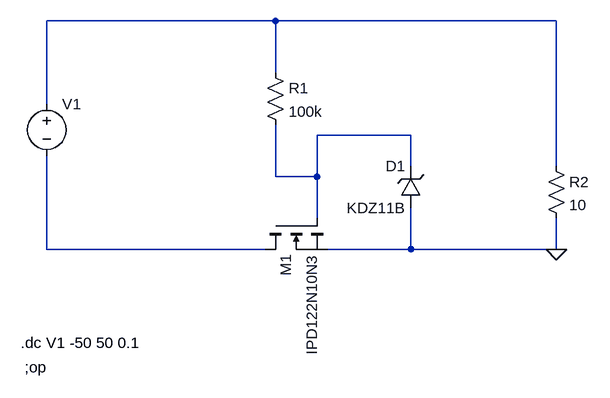
[diagram p0: schematic Draft1.asc]
Draft1.asc, the LTspice schematic file:
Version 4
SHEET 1 880 680
WIRE 288 -64 -64 -64
WIRE 720 -64 288 -64
WIRE 288 16 288 -64
WIRE -64 64 -64 -64
WIRE 496 112 352 112
WIRE 496 160 496 112
WIRE 720 160 720 -64
WIRE 288 176 288 96
WIRE 352 176 352 112
WIRE 352 176 288 176
WIRE 352 240 352 176
WIRE -64 288 -64 144
WIRE 272 288 -64 288
WIRE 496 288 496 224
WIRE 496 288 368 288
WIRE 720 288 720 240
WIRE 720 288 496 288
FLAG 720 288 0
SYMBOL res 272 0 R0
SYMATTR InstName R1
SYMATTR Value 100k
SYMBOL res 704 144 R0
SYMATTR InstName R2
SYMATTR Value 10
SYMBOL zener 512 224 R180
WINDOW 0 24 64 Left 2
WINDOW 3 24 0 Left 2
SYMATTR InstName D1
SYMATTR Value KDZ11B
SYMATTR Description Diode
SYMATTR Type diode
SYMBOL nmos 272 240 M90
SYMATTR InstName M1
SYMATTR Value IPD122N10N3
SYMBOL voltage -64 48 R0
SYMATTR InstName V1
SYMATTR Value ""
TEXT -98 470 Left 2 !;op
TEXT -104 432 Left 2 !.dc V1 -50 50 0.1

The netlist it stands for:
* Draft1.asc
R1 N001 N002 100k
R2 N001 0 10
D1 0 N002 KDZ11B
M1 N003 N002 0 0 IPD122N10N3
V1 N001 N003
.model D D
.lib standard.dio
.model NMOS NMOS
.model PMOS PMOS
.lib standard.mos
;op
.dc V1 -50 50 0.1
.backanno
.end